# EAGLE schematic lcd (EAGLE 6.5.0)
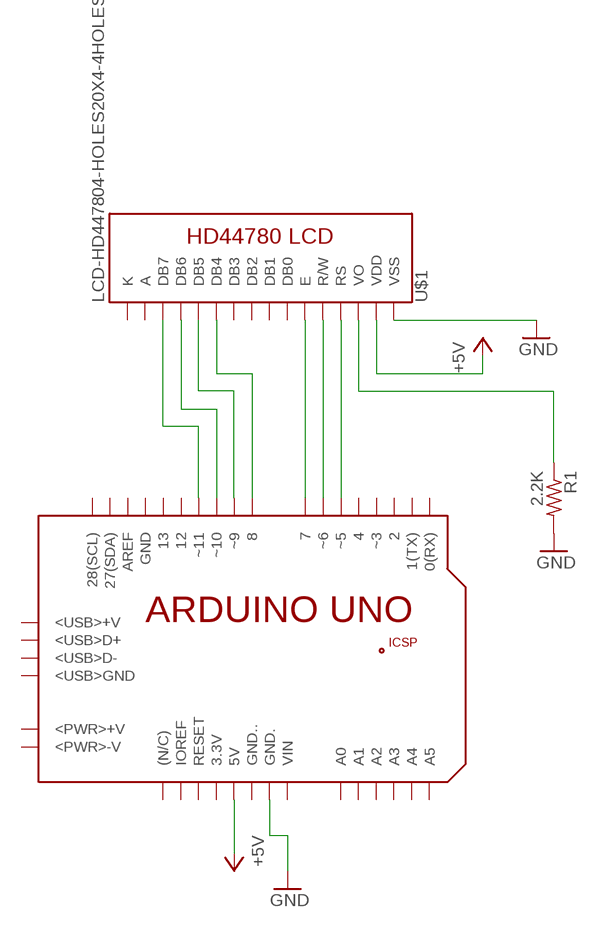
[diagram p0: schematic, sheet 1]

## Parts
PCB1  ARDUINO_UNO_EXT  (no package)
R1  2.2K  R-US_0204/5  [0204/5]
U$1  LCD-HD447804-HOLES20X4-4HOLES  [LCD-20X4-4HOLES]

## Nets
+5V: PCB1.5V U$1.P$2(VDD)
GND: PCB1.GND. R1.2
N$1: PCB1.8 U$1.P$11(DB4)
N$2: PCB1.~6 U$1.P$5(R/W)
N$3: PCB1.7 U$1.P$6(E)
N$4: R1.1 U$1.P$3(VO)
N$5: PCB1.~9 U$1.P$12(DB5)
N$6: PCB1.~10 U$1.P$13(DB6)
N$7: PCB1.~11 U$1.P$14(DB7)
N$9: PCB1.~5 U$1.P$4(RS)
Unconnected: PCB1.0(RX) PCB1.1(TX) PCB1.2 PCB1.3.3V PCB1.4 PCB1.12 PCB1.13 PCB1.27(SDA) PCB1.28(SCL) PCB1.(N/C) PCB1.+5V PCB1.<PWR>+V PCB1.<PWR>-V PCB1.<USB>+V PCB1.<USB>D+ PCB1.<USB>D- PCB1.<USB>GND PCB1.A0 PCB1.A1 PCB1.A2 PCB1.A3 PCB1.A4 PCB1.A5 PCB1.AREF PCB1.GND PCB1.GND.. PCB1.GND_ PCB1.IOREF PCB1.MISO PCB1.MOSI PCB1.RESET PCB1.RESET. PCB1.SCK PCB1.VIN PCB1.~3 U$1.P$7(DB0) U$1.P$8(DB1) U$1.P$9(DB2) U$1.P$10(DB3)

## Power pins joined to a net without a drawn wire
A: U$1.P$15(A)
K: U$1.P$16(K)
VSS: U$1.P$1(VSS)

## Library data of the parts
PCB1 = E14_Arduino:ARDUINO_UNO_EXT: Device for representing an Arduino Uno board in an EAGLE design without the PCB footprint. Created by Dave Young for Element14. More EAGLE documentation at: http://www.element14.com/community/community/knode/cadsoft_eagle
R1 = resistor:R-US_: RESISTOR, American symbol
U$1 = HD44780LCD:LCD-HD44780